# Altium schematic sheet imp_match_v1_1.SchDoc
size OrCAD E
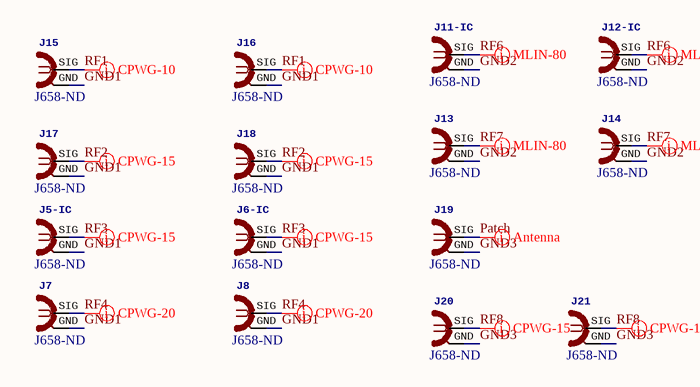
[diagram p0: imp_match_v1_1.SchDoc]

## Parts
J5-IC  Supplier Part Number 1: J658-ND  [SMA-OSHPARK-4L-1.6MM- ALT3]  (hidden comment: SMA 50 Ohm edge)
J6-IC  Supplier Part Number 1: J658-ND  [SMA-OSHPARK-4L-1.6MM- ALT3]  (hidden comment: SMA 50 Ohm edge)
J7  Supplier Part Number 1: J658-ND  [SMA-OSHPARK-4L-1.6MM- ALT3]  (hidden comment: SMA 50 Ohm edge)
J8  Supplier Part Number 1: J658-ND  [SMA-OSHPARK-4L-1.6MM- ALT3]  (hidden comment: SMA 50 Ohm edge)
J11-IC  Supplier Part Number 1: J658-ND  [SMA-OSHPARK-4L-1.6MM- ALT3]  (hidden comment: SMA 50 Ohm edge)
J12-IC  Supplier Part Number 1: J658-ND  [SMA-OSHPARK-4L-1.6MM- ALT3]  (hidden comment: SMA 50 Ohm edge)
J13  Supplier Part Number 1: J658-ND  [SMA-OSHPARK-4L-1.6MM- ALT3]  (hidden comment: SMA 50 Ohm edge)
J14  Supplier Part Number 1: J658-ND  [SMA-OSHPARK-4L-1.6MM- ALT3]  (hidden comment: SMA 50 Ohm edge)
J15  Supplier Part Number 1: J658-ND  [SMA-OSHPARK-4L-1.6MM- ALT3]  (hidden comment: SMA 50 Ohm edge)
J16  Supplier Part Number 1: J658-ND  [SMA-OSHPARK-4L-1.6MM- ALT3]  (hidden comment: SMA 50 Ohm edge)
J17  Supplier Part Number 1: J658-ND  [SMA-OSHPARK-4L-1.6MM- ALT3]  (hidden comment: SMA 50 Ohm edge)
J18  Supplier Part Number 1: J658-ND  [SMA-OSHPARK-4L-1.6MM- ALT3]  (hidden comment: SMA 50 Ohm edge)
J19  Supplier Part Number 1: J658-ND  [SMA-OSHPARK-4L-1.6MM- ALT3]  (hidden comment: SMA 50 Ohm edge)
J20  Supplier Part Number 1: J658-ND  [SMA-OSHPARK-4L-1.6MM- ALT3]  (hidden comment: SMA 50 Ohm edge)
J21  Supplier Part Number 1: J658-ND  [SMA-OSHPARK-4L-1.6MM- ALT3]  (hidden comment: SMA 50 Ohm edge)

## Nets
GND1: J5-IC.GND J6-IC.GND J7.GND J8.GND J15.GND J16.GND J17.GND J18.GND
GND2: J11-IC.GND J12-IC.GND J13.GND J14.GND
GND3: J19.GND J20.GND J21.GND
Patch: J19.SIG
RF1: J15.SIG J16.SIG
RF2: J17.SIG J18.SIG
RF3: J5-IC.SIG J6-IC.SIG
RF4: J7.SIG J8.SIG
RF6: J11-IC.SIG J12-IC.SIG
RF7: J13.SIG J14.SIG
RF8: J20.SIG J21.SIG

## Layout directives
rule Width Constraint [Pref Width = 13.643mil    Min Width = 13.643mil    Max Width = 13.643mil]; rule Clearance Constraint [Generic clearance = 20mil, and 9 value(s) for objects]: RF4
rule Width Constraint [Pref Width = 12.181mil    Min Width = 12.181mil    Max Width = 12.181mil]; rule Clearance Constraint [Generic clearance = 10mil, and 9 value(s) for objects]: RF1
rule Width Constraint [Pref Width = 13.094mil    Min Width = 13.094mil    Max Width = 13.094mil]; rule Clearance Constraint [Generic clearance = 15mil, and 9 value(s) for objects]: RF2, RF3
rule Width Constraint [Pref Width = 12.101mil    Min Width = 12.101mil    Max Width = 12.101mil]; rule Clearance Constraint [Generic clearance = 80mil, and 9 value(s) for objects]: RF6, RF7
rule Clearance Constraint [Generic clearance = 20mil, and 15 value(s) for objects]: Patch
rule Width Constraint [Pref Width = 13.094mil    Min Width = 13.094mil    Max Width = 101mil]; rule Clearance Constraint [Generic clearance = 15mil, and 9 value(s) for objects]: RF8

## Library data of the parts
J5-IC J6-IC J7 J8 J11-IC J12-IC J13-J21 = SMA-OSHPARK-4L-1.6MM-ALT3: GateName_1: G1; SymbolName_1: COAX; DeviceName: -OSHPARK-4L-1.6MM; LibraryName: dword1511-connectors; DeviceSetName: SMA; Package: SMA-OSHPARK-4L-1.6MM; Supplier 1: Digi-Key